# Altium schematic sheet Pg08_HDMI.SchDoc: HDMI FRAMER CONNECTIVITY
size A3; DrawnBy: RvS; DocumentNumber: 8; SheetNumber: 8; SheetTotal: 16
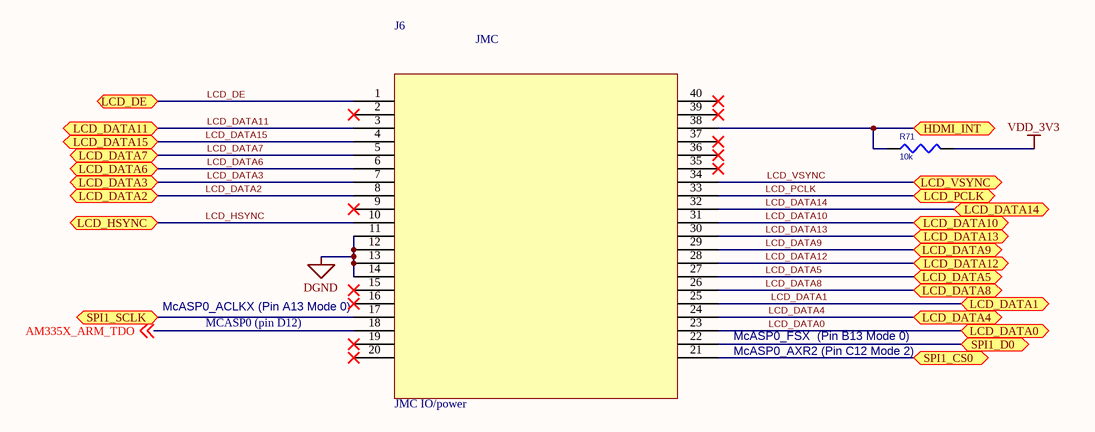
[diagram p0: Pg08_HDMI.SchDoc]

## Parts
?  (no value)  (graphical)
J6  JMC IO/power  [40 Pin Female]
R71  10k  [402]

## Ports
HDMI_INT, LCD_DATA0, LCD_DATA1, LCD_DATA2, LCD_DATA3, LCD_DATA4, LCD_DATA5, LCD_DATA6, LCD_DATA7, LCD_DATA8, LCD_DATA9, LCD_DATA10, LCD_DATA11, LCD_DATA12, LCD_DATA13, LCD_DATA14, LCD_DATA15, LCD_DE, LCD_HSYNC, LCD_PCLK, LCD_VSYNC, SPI1_CS0, SPI1_D0, SPI1_SCLK

## Nets
DGND: J6.11 J6.12 J6.13 J6.14
VDD_3V3: R71.1(P1)
AM335X_ARM_TDO: J6.18 ; off-sheet AM335X_ARM_TDO
HDMI_INT: J6.38 R71.2(P2) ; port HDMI_INT
LCD_DATA0: J6.23 ; port LCD_DATA0
LCD_DATA1: J6.25 ; port LCD_DATA1
LCD_DATA2: J6.8 ; port LCD_DATA2
LCD_DATA3: J6.7 ; port LCD_DATA3
LCD_DATA4: J6.24 ; port LCD_DATA4
LCD_DATA5: J6.27 ; port LCD_DATA5
LCD_DATA6: J6.6 ; port LCD_DATA6
LCD_DATA7: J6.5 ; port LCD_DATA7
LCD_DATA8: J6.26 ; port LCD_DATA8
LCD_DATA9: J6.29 ; port LCD_DATA9
LCD_DATA10: J6.31 ; port LCD_DATA10
LCD_DATA11: J6.3 ; port LCD_DATA11
LCD_DATA12: J6.28 ; port LCD_DATA12
LCD_DATA13: J6.30 ; port LCD_DATA13
LCD_DATA14: J6.32 ; port LCD_DATA14
LCD_DATA15: J6.4 ; port LCD_DATA15
LCD_DE: J6.1 ; port LCD_DE
LCD_HSYNC: J6.10 ; port LCD_HSYNC
LCD_PCLK: J6.33 ; port LCD_PCLK
LCD_VSYNC: J6.34 ; port LCD_VSYNC
SPI1_CS0: J6.21 ; port SPI1_CS0
SPI1_D0: J6.22 ; port SPI1_D0
SPI1_SCLK: J6.17 ; port SPI1_SCLK

Not connected (* = marked no-connect by the designer): J6 2* 9* 15* 16* 19* 20* 35* 36* 37* 39* 40*

## Notes on the sheet
- McASP0_ACLKX (Pin A13 Mode 0)
- MCASP0 (pin D12)
- McASP0_FSX  (Pin B13 Mode 0)
- McASP0_AXR2 (Pin C12 Mode 2)
- Embedded Vision Systems Group
- School of Electrical and Electronic Engineering
- Size
- Title
- Document Number
- Rev
- Date:
- Sheet
- of
- (in symbol JMC 40-pin) JMC

## Library data of the parts
? = Title Block Address(1): UoM title block
J6 = JMC 40-pin: JST JMC 40 pin connector
R71 = RES SMD: RES 10K OHM 1/16W 5% 0402 SMD; Manufacturer: Rohm Semiconductor; Manufacturer Part Number: MCR01MZPJ103; Power (Watts): 0.063W, 1/16W; Temperature Coefficient: ±200ppm/°C; Supplier 1: Digi-Key; Supplier Part Number 1: RHM10KJDKR-ND; RoHS: RoHS Compliant; Category: Resistors; Stock 1: 460442; Pricing 1: 1=0.1, 10=0.019, 25=0.014, 100=0.0078, 250=0.00596, 500=0.00476, 1000=0.0035, 5000=0.00251 (USD); Resistance (Ohms): 10k; Composition: Thick Film; Features: Automotive AEC-Q200 Qualified; Tolerance: ±5%; Package / Case: 0402 (1005 Metric); Supplier Device Package: 0402 (1005 Metric); Size / Dimension: 0.039" L x 0.020" W (1.00mm x 0.50mm); Height: 0.016" (0.40mm); Number of Terminations: 2; Packaging: Digi-Reel®; ComponentLink1URL: http://rohmfs.rohm.com/en/products/databook/datasheet/passive/resistor/chip_resistor/mcr_a.pdf; ComponentLink1Description: http://rohmfs.rohm.com/en/products/databook/datasheet/passive/resistor/chip_resistor/mcr_a.pdf